# Altium schematic sheet uMultimeter_ExpProbeA_Sch.SchDoc: MicroMultimeter_ExpProbeA
size 127 x 101 mm; Author: Hom; CompanyName: KitSprout; DrawnBy: Hom; Engineer: Hom; Organization: KitSprout; Revision: A; SheetNumber: 1; SheetTotal: 1; License: CC BY-SA 4.0; Version: 1.0; LibVersion: 1.4; PageSetup: Record=PageOptions|CenterHorizontal=True|CenterVertical=True|PrintScale=1.00|XCorrection=1.00|YCorrection=1.00|PrintKind=0|BorderSize=5000000|LeftOffset=0|BottomOffset=0|Orientation=2|PaperLength=1000|PaperWidth=1000|Scale=100|PaperSource=7|PrintQuality=-3|MediaType=1|DitherType=10|PrintScaleMode=0|PaperKind=A4|PaperIndex=9
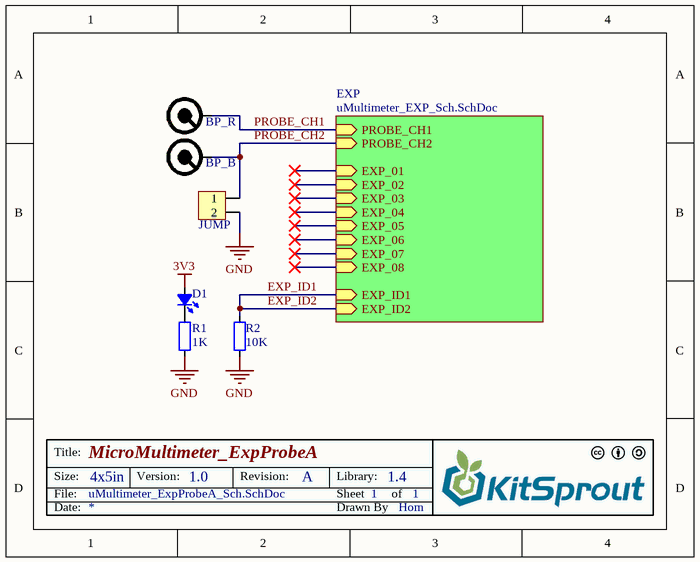
[diagram p0: uMultimeter_ExpProbeA_Sch.SchDoc]

## Parts
BP_B  BananaPlugs  [BananaPlugs_Black]  (value not drawn)
BP_R  BananaPlugs  [BananaPlugs_Red]  (value not drawn)
D1  LED_0805  [LED_0805_BLUE]  (value not drawn)
JUMP  HDR1x2_2.54  [HDR1X2_2.54_180]  (value not drawn)
R1  value 1K  [RES_0603]  (hidden comment: Res_0603)
R2  value 10K  [RES_0603]  (hidden comment: Res_0603)

## Sub-sheets
EXP = uMultimeter_EXP_Sch.SchDoc: PROBE_CH1 (in), PROBE_CH2 (in), EXP_01 (in), EXP_02 (in), EXP_03 (in), EXP_04 (in), EXP_05 (in), EXP_06 (in), EXP_07 (in), EXP_08 (in), EXP_ID1 (in), EXP_ID2 (in)

## Nets
3V3: D1.1(A)
GND: JUMP.2 R1.2 R2.1
EXP_ID1: R2.2 ; sheet EXP/EXP_ID1, sheet EXP/EXP_ID2  [also labelled EXP_ID2]
PROBE_CH1: BP_R.1 ; sheet EXP/PROBE_CH1
PROBE_CH2: BP_B.1 JUMP.1 ; sheet EXP/PROBE_CH2
NetD1_2: D1.2(K) R1.1

## Notes on the sheet
- Title:
- Size:
- Date:
- File:
- 4x5in
- Version:
- Revision:
- Sheet
- Drawn By
- Library:
- of

## Library data of the parts
D1 = LED_0805: LED
JUMP = HDR1x2_2.54T: Header
R1 R2 = Res_0603: Resistor